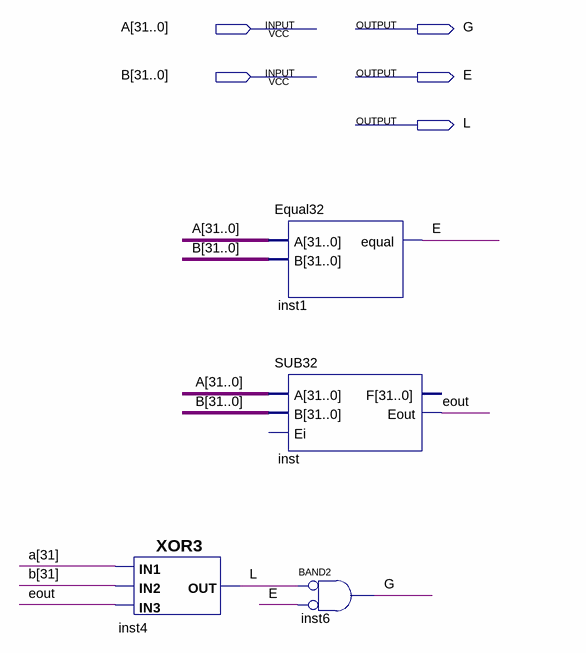
[diagram p0: schematic sheet]
// Quartus schematic GEL32.bdf as structural Verilog: 4 symbols, 5 pins
module GEL32 (
  input  [31:0] A,
  input  [31:0] B,
  output G,
  output E,
  output L
);

  wire eout;

  XOR3 inst4 (.IN3(eout), .IN1(A[31]), .IN2(B[31]), .OUT(L));
  Equal32 inst1 (.A(A), .B(B), .equal(E));
  SUB32 inst (.A(A), .B(B), .Eout(eout));  // open: Ei, F
  and inst6 (G, ~L, ~E);  // BAND2
endmodule
